# EAGLE schematic eDuinoUno (EAGLE 6.6.0)
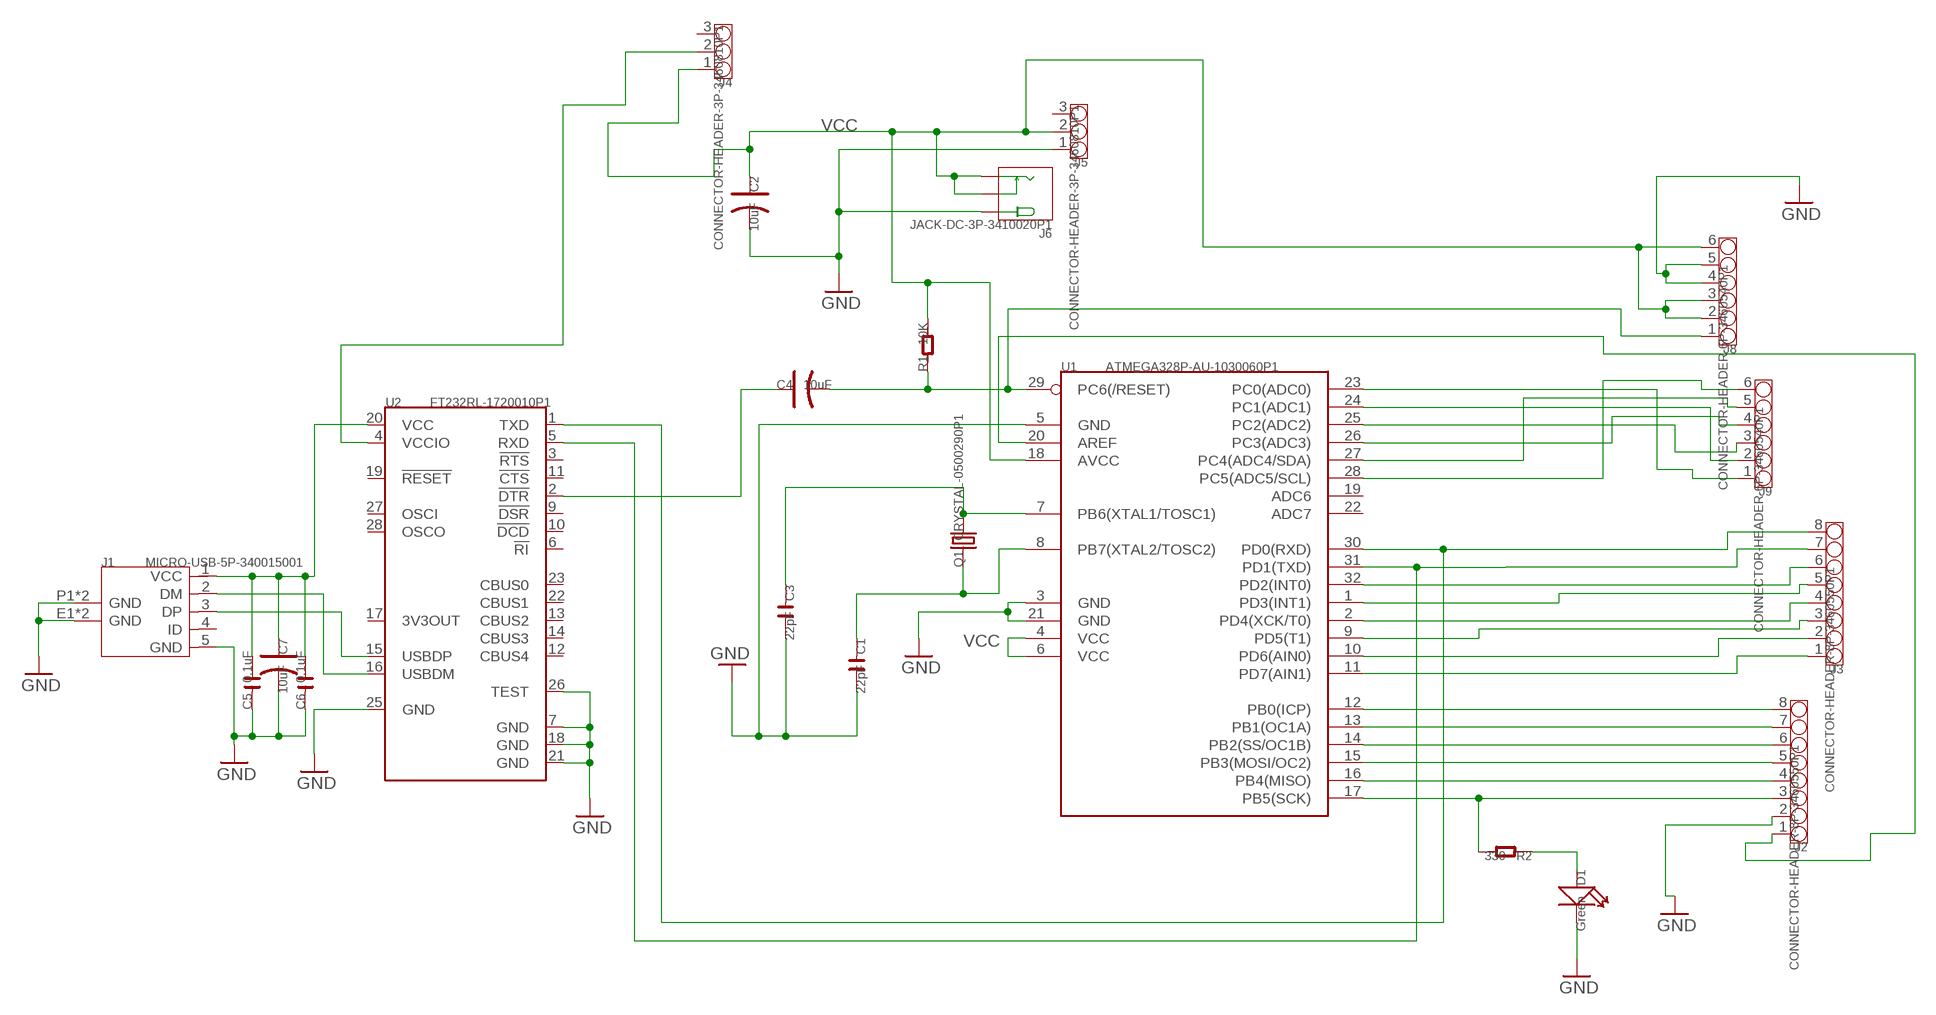
[diagram p0: schematic, sheet 1]

## Parts
C1  22pF  C-0603  [C0603]
C2  10uF  C-POLAR-A  [AVX-A]
C3  22pF  C-0603  [C0603]
C4  10uF  C-POLAR-A  [AVX-A]
C5  0.1uF  C-0603  [C0603]
C6  0.1uF  C-0603  [C0603]
C7  10uF  C-POLAR-A  [AVX-A]
D1  Green  LED  [LED0603]
J1  MICRO-USB-5P-340015001  [B-SMD-5P]
J2  CONNECTOR-HEADER-8P-3460550P1  [1X8P-2.54-8.5-WHITE-FEMALE]
J3  CONNECTOR-HEADER-8P-3460550P1  [1X8P-2.54-8.5-WHITE-FEMALE]
J4  CONNECTOR-HEADER-3P-3460810P1  [1X3P-2.54-2.54-11.6-3.0-BLACK-MALE]
J5  CONNECTOR-HEADER-3P-3460810P1  [1X3P-2.54-2.54-11.6-3.0-BLACK-MALE]
J6  JACK-DC-3P-3410020P1  [PW-3P-2.1]
J8  CONNECTOR-HEADER-6P-3460540P1  [1X6P-2.54-8.5-WHITE-FEMALE]
J9  CONNECTOR-HEADER-6P-3460540P1  [1X6P-2.54-8.5-WHITE-FEMALE]
Q1  CRYSTAL-0500290P1  [2P-SMD-5.0X3.2]
R1  10K  R-0603  [R0603]
R2  330  R-0603  [R0603]
U1  ATMEGA328P-AU-1030060P1  [TQFP32]
U2  FT232RL-1720010P1  [SSOP28]

## Nets
GND [gnd]: C1.2 C2.- C3.2 C5.1 C6.1 C7.- D1.- J1.5(GND) J1.E1(GND) J1.E2(GND) J1.P1(GND) J1.P2(GND) J2.2 J5.1 J6.+ J8.4 J8.5 U1.3(GND) U1.5(GND) U1.21(GND) U2.7(GND) U2.18(GND) U2.21(GND) U2.25(GND) U2.26(TEST)
N$1: J9.1 U1.23(PC0(ADC0))
N$2: J9.2 U1.24(PC1(ADC1))
N$3: J9.3 U1.25(PC2(ADC2))
N$4: C1.1 Q1.1 U1.8(PB7(XTAL2/TOSC2))
N$5: J9.5 U1.27(PC4(ADC4/SDA))
N$6: J9.6 U1.28(PC5(ADC5/SCL))
N$7: J3.8 U1.30(PD0(RXD)) U2.1(TXD)
N$9: J3.7 U1.31(PD1(TXD)) U2.5(RXD)
N$10: C5.2 C6.2 C7.+ J1.1(VCC) U2.20(VCC)
N$11: J1.2(DM) U2.16(USBDM)
N$13: J3.6 U1.32(PD2(INT0))
N$14: J2.3 R2.2 U1.17(PB5(SCK))
N$15: J2.4 U1.16(PB4(MISO))
N$16: J2.5 U1.15(PB3(MOSI/OC2))
N$17: J3.5 U1.1(PD3(INT1))
N$18: J9.4 U1.26(PC3(ADC3))
N$19: J3.3 U1.9(PD5(T1))
N$20: J3.2 U1.10(PD6(AIN0))
N$21: J1.3(DP) U2.15(USBDP)
N$22: C4.+ U2.2(!DTR)
N$23: J4.2 U2.4(VCCIO)
N$24: C4.- J8.1 R1.1 U1.29(PC6(/RESET))
N$25: J2.8 U1.12(PB0(ICP))
N$26: J2.7 U1.13(PB1(OC1A))
N$27: J2.6 U1.14(PB2(SS/OC1B))
N$28: J3.4 U1.2(PD4(XCK/T0))
N$29: J2.1 U1.20(AREF)
N$30: J3.1 U1.11(PD7(AIN1))
N$31: D1.+ R2.1
VCC [usbvcc]: C2.+ J4.1 J5.2 J6.-1(-) J6.-2(CDN) J8.2 J8.3 J8.6 R1.2 U1.4(VCC) U1.6(VCC) U1.18(AVCC)
XTAL2: C3.1 Q1.2 U1.7(PB6(XTAL1/TOSC1))
Unconnected: J1.4(ID) J4.3 J5.3 U1.19(ADC6) U1.22(ADC7) U2.3(!RTS) U2.6(!RI) U2.9(!DSR) U2.10(!DCD) U2.11(!CTS) U2.12(CBUS4) U2.13(CBUS2) U2.14(CBUS3) U2.17(3V3OUT) U2.19(!RESET) U2.22(CBUS1) U2.23(CBUS0) U2.27(OSCI) U2.28(OSCO)

## Library data of the parts
C1 C3 C5 C6 = OPL Eagle Library:C*
C2 C4 C7 = OPL Eagle Library:C-POLAR*
D1 = OPL Eagle Library:LED*: LED
J1 = OPL Eagle Library:MICRO-USB-5P: ST-USB-001E：MICRO USB B SMD R/A
J2 J3 = OPL Eagle Library:CONNECTOR-HEADER-8P
J4 J5 = OPL Eagle Library:CONNECTOR-HEADER-3P
J6 = OPL Eagle Library:JACK-DC-3P
J8 J9 = OPL Eagle Library:CONNECTOR-HEADER-6P
Q1 = OPL Eagle Library:CRYSTAL*
R1 R2 = OPL Eagle Library:R*
U1 = OPL Eagle Library:ATMEGA328P-AU: 8-bit AVR Microcontroller with 32K Bytes In-System Programmable Flash
U2 = OPL Eagle Library:FT232RL: USB UART IC Source: http://www.ftdichip.com/Documents/DataSheets/DS_FT232R_v104.pdf

## Net classes
0 default: width 0.152 mm, clearance 0.152 mm
1 power: width 0.61 mm, drill 0.61 mm, clearance 0.254 mm
2 gnd: width 0.203 mm, drill 0.559 mm, clearance 0.152 mm
3 usbvcc: width 0.203 mm, drill 0.61 mm, clearance 0.152 mm
4 aref: width 0.406 mm, drill 0.61 mm, clearance 0.254 mm